# EAGLE design wiring_bord-old (EAGLE 9.5.2)
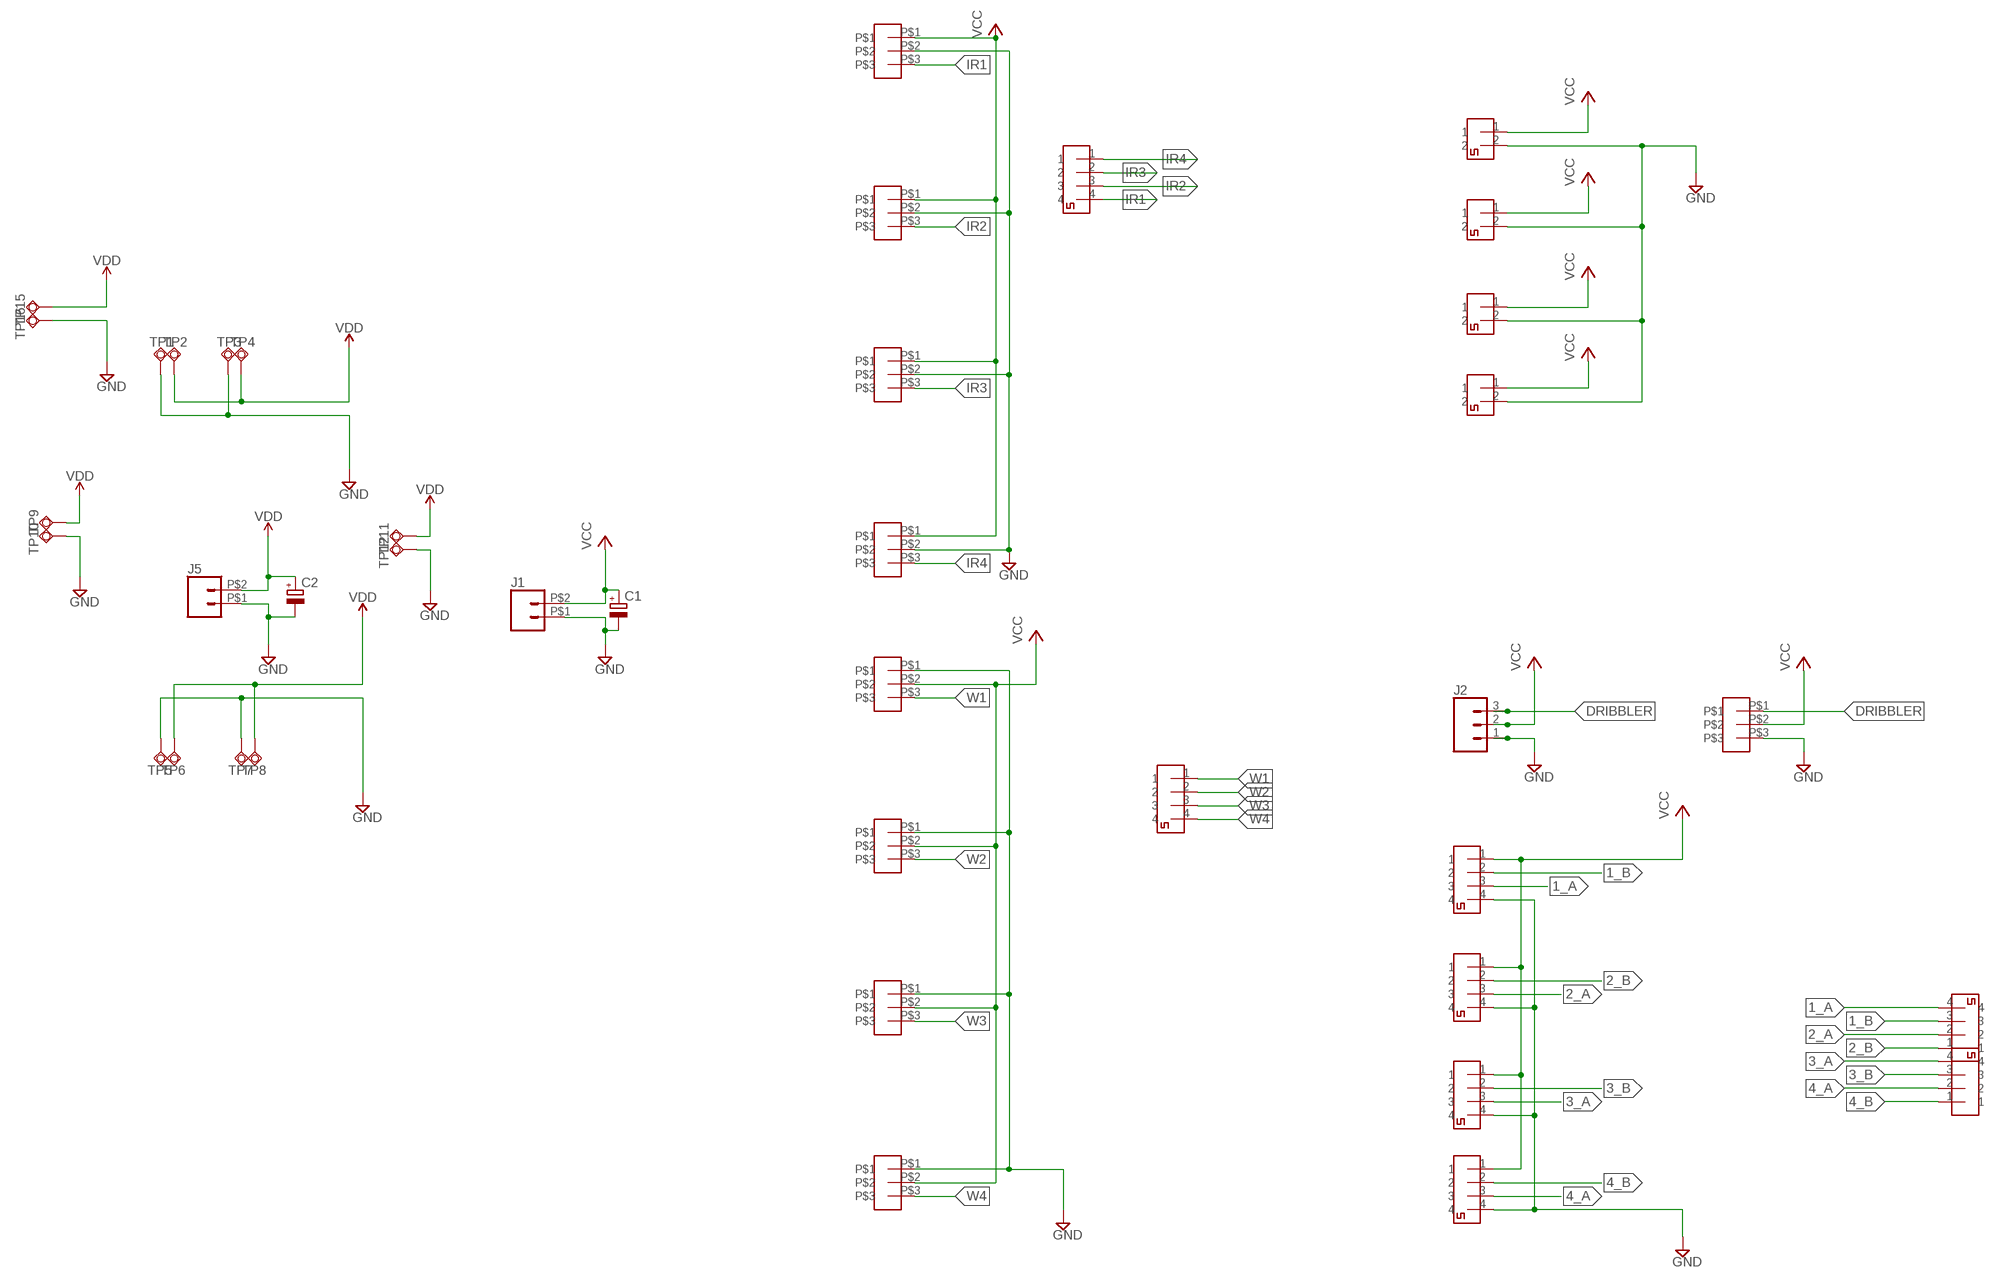
[diagram p0: schematic, sheet 1]

## Parts
C1  CPOL-EUE2-5  [E2-5]
C2  CPOL-EUE2-5  [E2-5]
CONNECTOR1  2PIN  [2PIN]
CONNECTOR2  2PIN  [2PIN]
CONNECTOR3  2PIN  [2PIN]
CONNECTOR4  2PIN  [2PIN]
CONNECTOR5  2PIN  [2PIN]
CONNECTOR6  2PIN  [2PIN]
CONNECTOR7  2PIN  [2PIN]
CONNECTOR8  2PIN  [2PIN]
ENCODER1  2PIN  [2PIN]
ENCODER2  2PIN  [2PIN]
ENCODER3  2PIN  [2PIN]
ENCODER4  2PIN  [2PIN]
IR_DISTANCE1  3PIN  [3PIN]
IR_DISTANCE2  3PIN  [3PIN]
IR_DISTANCE3  3PIN  [3PIN]
IR_DISTANCE4  3PIN  [3PIN]
J1  CONN_02PTH2  [1X02_BIG]
J2  CONN_03  [1X03]
J5  CONN_02PTH2  [1X02_BIG]
TP1  TESTPAD_TPSQPAD1-20  [TESTPAD_P1-20]
TP2  TESTPAD_TPSQPAD1-20  [TESTPAD_P1-20]
TP3  TESTPAD_TPSQPAD1-20  [TESTPAD_P1-20]
TP4  TESTPAD_TPSQPAD1-20  [TESTPAD_P1-20]
TP5  TESTPAD_TPSQPAD1-20  [TESTPAD_P1-20]
TP6  TESTPAD_TPSQPAD1-20  [TESTPAD_P1-20]
TP7  TESTPAD_TPSQPAD1-20  [TESTPAD_P1-20]
TP8  TESTPAD_TPSQPAD1-20  [TESTPAD_P1-20]
TP9  TESTPAD_TPSQPAD1-20  [TESTPAD_P1-20]
TP10  TESTPAD_TPSQPAD1-20  [TESTPAD_P1-20]
TP11  TESTPAD_TPSQPAD1-20  [TESTPAD_P1-20]
TP12  TESTPAD_TPSQPAD1-20  [TESTPAD_P1-20]
TP15  TESTPAD_TPSQPAD1-13  [TESTPAD_P1-13]
TP16  TESTPAD_TPSQPAD1-13  [TESTPAD_P1-13]
WHITE1  3PIN  [3PIN]
WHITE2  3PIN  [3PIN]
WHITE3  3PIN  [3PIN]
WHITE4  3PIN  [3PIN]
WHITE5  3PIN  [3PIN]

## Nets
1_A: CONNECTOR3.4 ENCODER1.3
1_B: CONNECTOR3.3 ENCODER1.2
2_A: CONNECTOR3.2 ENCODER2.3
2_B: CONNECTOR3.1 ENCODER2.2
3_A: CONNECTOR4.4 ENCODER3.3
3_B: CONNECTOR4.3 ENCODER3.2
4_A: CONNECTOR4.2 ENCODER4.3
4_B: CONNECTOR4.1 ENCODER4.2
DRIBBLER: J2.3 WHITE5.P$1
GND: C1.- C2.- CONNECTOR5.2 CONNECTOR6.2 CONNECTOR7.2 CONNECTOR8.2 ENCODER1.4 ENCODER2.4 ENCODER3.4 ENCODER4.4 IR_DISTANCE1.P$2 IR_DISTANCE2.P$2 IR_DISTANCE3.P$2 IR_DISTANCE4.P$2 J1.P$1 J2.1 J5.P$1 TP1.TP TP3.TP TP5.TP TP7.TP TP10.TP TP12.TP TP16.TP WHITE1.P$1 WHITE2.P$1 WHITE3.P$1 WHITE4.P$1 WHITE5.P$3
IR1: CONNECTOR1.4 IR_DISTANCE1.P$3
IR2: CONNECTOR1.3 IR_DISTANCE2.P$3
IR3: CONNECTOR1.2 IR_DISTANCE3.P$3
IR4: CONNECTOR1.1 IR_DISTANCE4.P$3
VCC: C1.+ CONNECTOR5.1 CONNECTOR6.1 CONNECTOR7.1 CONNECTOR8.1 ENCODER1.1 ENCODER2.1 ENCODER3.1 ENCODER4.1 IR_DISTANCE1.P$1 IR_DISTANCE2.P$1 IR_DISTANCE3.P$1 IR_DISTANCE4.P$1 J1.P$2 J2.2 WHITE1.P$2 WHITE2.P$2 WHITE3.P$2 WHITE4.P$2 WHITE5.P$2
VDD: C2.+ J5.P$2 TP2.TP TP4.TP TP6.TP TP8.TP TP9.TP TP11.TP TP15.TP
W1: CONNECTOR2.1 WHITE1.P$3
W2: CONNECTOR2.2 WHITE2.P$3
W3: CONNECTOR2.3 WHITE3.P$3
W4: CONNECTOR2.4 WHITE4.P$3

## Library data of the parts
C1 C2 = rcl:CPOL-EU: POLARIZED CAPACITOR, European symbol; SPICEPREFIX: C
CONNECTOR1-CONNECTOR4 ENCODER1-ENCODER4 = 4pin_small:2PIN: 2pin
CONNECTOR5-CONNECTOR8 = 2pin_small:2PIN: 2pin
IR_DISTANCE1-IR_DISTANCE4 WHITE1-WHITE5 = 3PIN_2:3PIN
J1 J5 = SparkFun-Connectors:CONN_02: Multi connection point. Often used as Generic Header-pin footprint for 0.1 inch spaced/style header connections On any of the 0.1 inch spaced packages, you can populate with these: Break Away Headers - Straight <https://www.sparkfun.com/products/116> (PRT-00116) Break Away Male Headers - Right Angle <https://www.sparkfun.com/products/553> (PRT-00553) Female Headers <https://www.sparkfun.com/products/115> (PRT-00115) Break Away Headers - Machine Pin <https://www.sparkfun.com/products/117> (PRT-00117) Break Away Female Headers - Swiss Machine Pin <https://www.sparkfun.com/products/743> (PRT-00743) For SCREWTERMINALS and SPRING TERMINALS visit here: Screw Terimnals on SparkFun.com <https://www.sparkfun.com/search/results?term=Screw+Terminals> (5mm/3.5mm/2.54mm spacing) This device is also useful as a general connection point to wire up your design to another part of your project. Our various solder wires solder well into these plated through hole pads. Hook-Up Wire - Assortment (Stranded, 22 AWG) <https://www.sparkfun.com/products/11375> (PRT-11375) Hook-Up Wire - Assortment (Solid Core, 22 AWG) <https://www.sparkfun.com/products/11367> (PRT-11367) View the entire wire category on our website here <https://www.sparkfun.com/categories/141> Special notes: Molex polarized connector foot print use with: PRT-08233 with associated crimp pins and housings. 2.54_SCREWTERM for use with PRT-10571. 3.5mm Screw Terminal footprints for PRT-08084 5mm Screw Terminal footprints for use with PRT-08432
J2 = SparkFun-Connectors:CONN_03: Multi connection point. Often used as Generic Header-pin footprint for 0.1 inch spaced/style header connections On any of the 0.1 inch spaced packages, you can populate with these: Break Away Headers - Straight <https://www.sparkfun.com/products/116> (PRT-00116) Break Away Male Headers - Right Angle <https://www.sparkfun.com/products/553> (PRT-00553) Female Headers <https://www.sparkfun.com/products/115> (PRT-00115) Break Away Headers - Machine Pin <https://www.sparkfun.com/products/117> (PRT-00117) Break Away Female Headers - Swiss Machine Pin <https://www.sparkfun.com/products/743> (PRT-00743) Stackable Header - 3 Pin (Female, 0.1") <https://www.sparkfun.com/products/13875> (PRT-13875) For SCREWTERMINALS and SPRING TERMINALS visit here: Screw Terimnals on SparkFun.com <https://www.sparkfun.com/search/results?term=Screw+Terminals> (5mm/3.5mm/2.54mm spacing) This device is also useful as a general connection point to wire up your design to another part of your project. Our various solder wires solder well into these plated through hole pads. Hook-Up Wire - Assortment (Stranded, 22 AWG) <https://www.sparkfun.com/products/11375> (PRT-11375) Hook-Up Wire - Assortment (Solid Core, 22 AWG) <https://www.sparkfun.com/products/11367> (PRT-11367) View the entire wire category on our website here <https://www.sparkfun.com/categories/141> Special notes: Molex polarized connector foot print use with SKU : PRT-08232 with associated crimp pins and housings.
TP1-TP12 TP15 TP16 = BeagleBone_Blue_R3:TESTPAD_TPSQ: Test pad

## Board
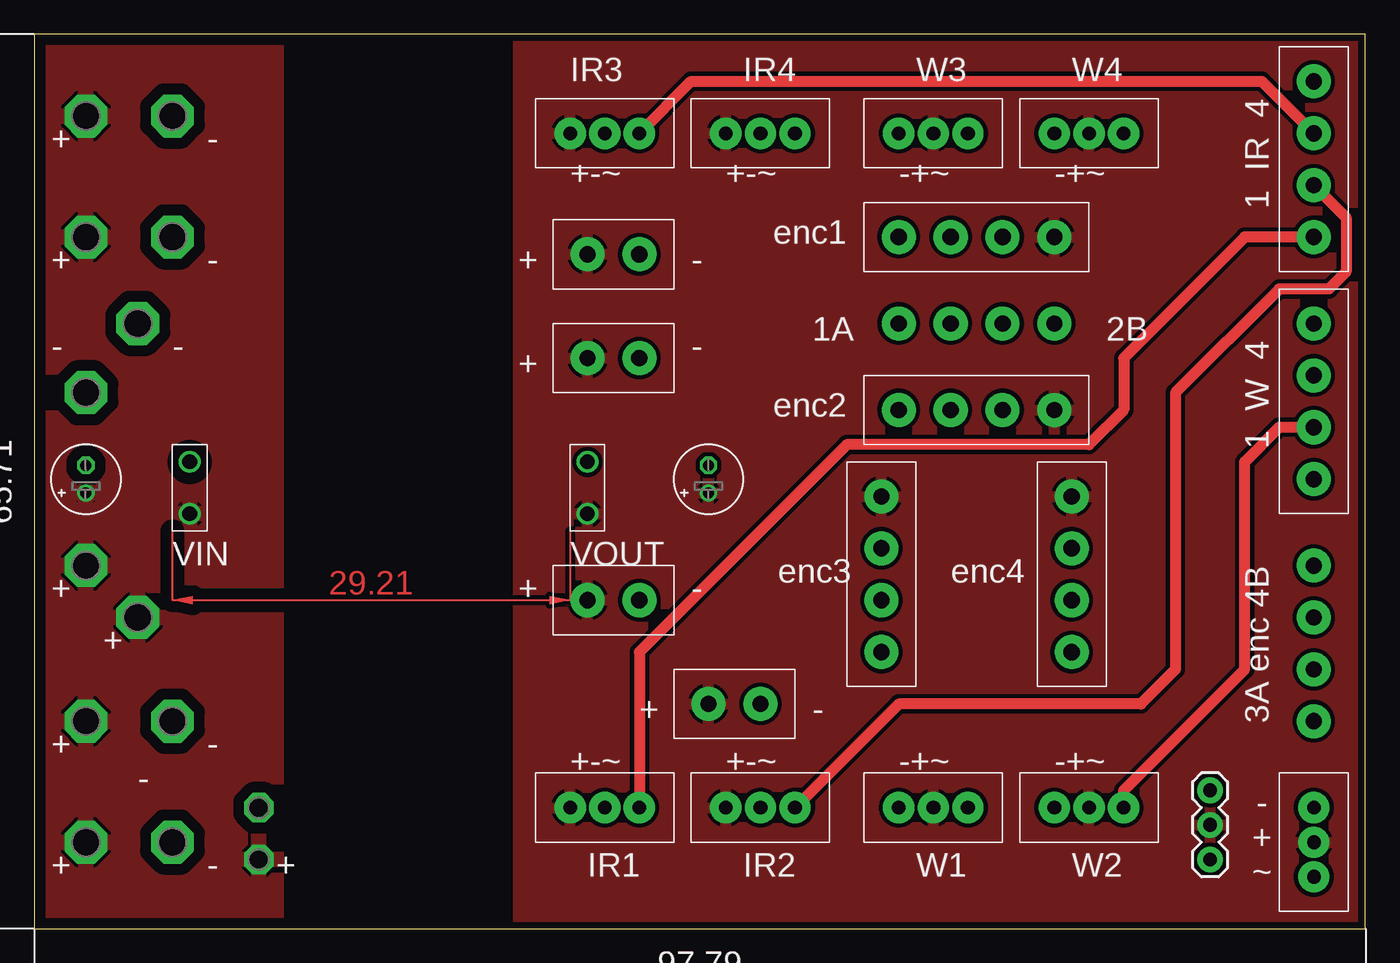
[diagram p1: board, top side]
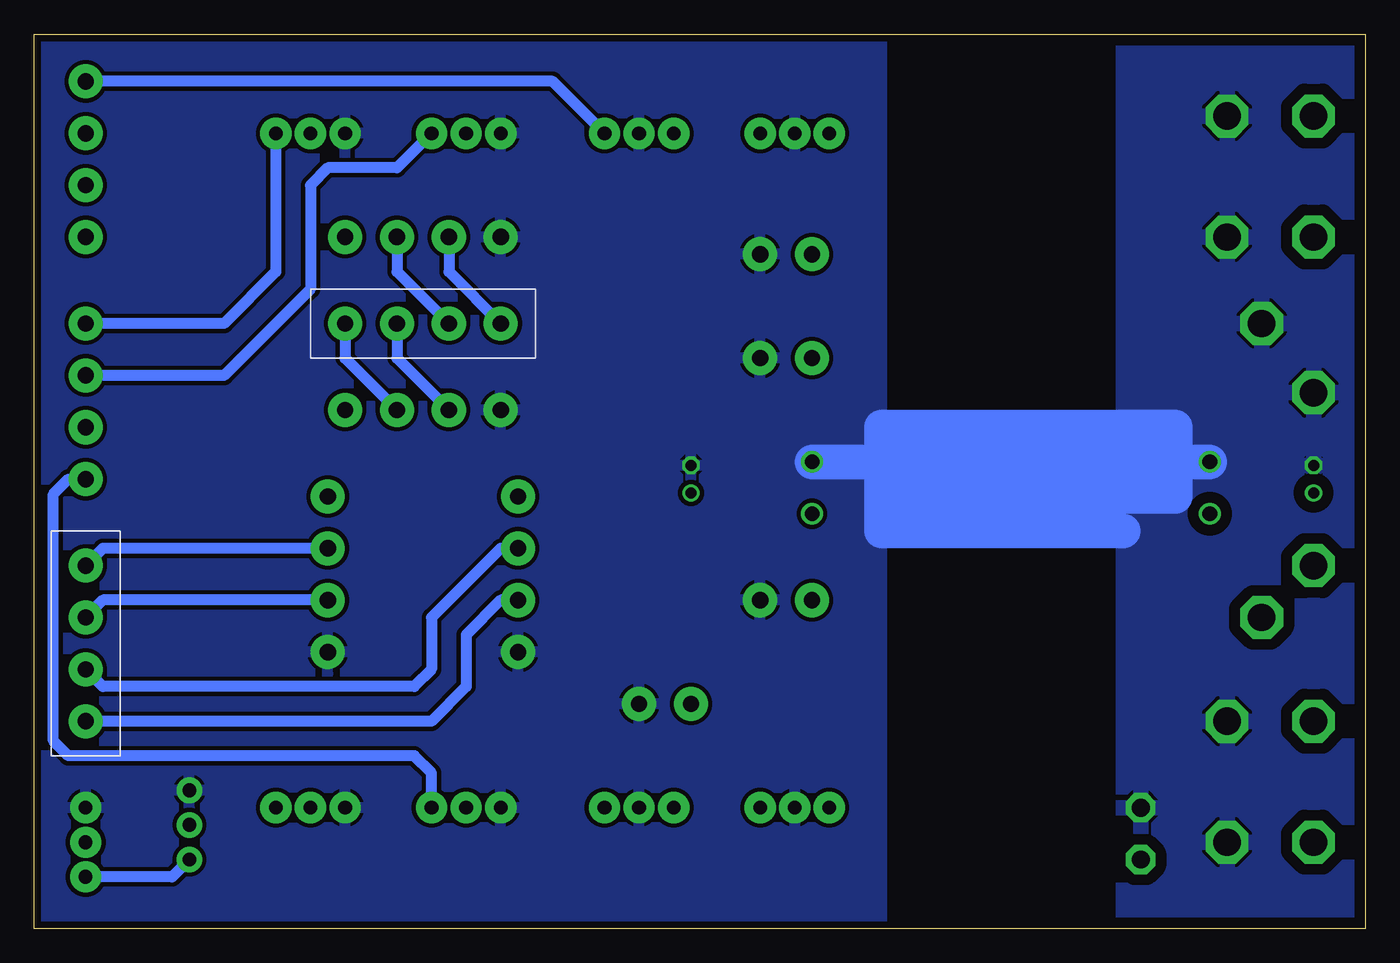
[diagram p2: board, bottom side, seen from below]

Size 97.77 x 65.71 mm. Coordinates in mm from the lower left corner, seen from the top.
Outline: 0,0 97.77,0 97.77,65.71 0,65.71 0,0
Copper layers (1*16): Top 0.035mm / dielectric 1.6mm / Bottom 0.035mm
Design rules "Elecrow_2-layer_PCB_eagle_rule": minimum track width 6mil, minimum drill 12mil, track to track 6mil, track to pad 6mil, pad to pad 6mil, via to via 8mil, smd to smd 0mil, copper to edge 20mil, drill to drill 10mil, minimum pad ring 6mil, minimum via ring 6mil, stop-mask expansion 0mil, vias tented up to drill 100mil, thermal gap 10mil

### Footprints (pad centres in the part's own frame; a part is rotated, then mirrored left to right if it is on the bottom)
E2-5 = drill 0.813 pad 1.27: + -1.016,0 | drill 0.813 pad 1.27 octagon: - 1.016,0
2PIN = drill 1.2 pad 2.5: 1 0,0; 2 3.81,0; 3 7.62,0; 4 11.43,0
2PIN' = drill 1.2 pad 2.5: 1 0,0; 2 3.81,0
3PIN = drill 1 pad 2.3: P$1 0,0; P$2 2.54,0; P$3 5.08,0
1X02_BIG = drill 1.067: P$1 0,0; P$2 3.81,0
1X03 = drill 1.016 pad 1.88: 1 0,0; 2 2.54,0; 3 5.08,0
TESTPAD_P1-20 = drill 2.007 pad 3.15 octagon: TP 0,0
TESTPAD_P1-13 = drill 1.321 pad 2.159 octagon: TP 0,0

### Placement (x,y rotation side)
C1  49.53,33.02 90 top
C2  3.81,33.02 90 top
CONNECTOR1  93.98,62.23 270 top
CONNECTOR2  93.98,33.02 90 top
CONNECTOR3  74.93,44.45 0 bottom
CONNECTOR4  93.98,26.67 270 bottom
CONNECTOR5  2PIN  [2PIN']  40.64,49.53 0 top
CONNECTOR6  2PIN  [2PIN']  40.64,41.91 0 top
CONNECTOR7  2PIN  [2PIN']  49.53,16.51 0 top
CONNECTOR8  2PIN  [2PIN']  40.64,24.13 0 top
ENCODER1  74.93,50.8 180 top
ENCODER2  74.93,38.1 180 top
ENCODER3  62.23,31.75 270 top
ENCODER4  76.2,31.75 270 top
IR_DISTANCE1  39.37,8.89 0 top
IR_DISTANCE2  50.8,8.89 0 top
IR_DISTANCE3  39.37,58.42 0 top
IR_DISTANCE4  50.8,58.42 0 top
J1  40.64,34.29 270 top
J2  86.36,10.16 270 top
J5  11.43,34.29 270 top
TP1  10.16,59.69 0 top
TP2  3.81,59.69 0 top
TP3  10.16,50.8 0 top
TP4  3.81,50.8 0 top
TP5  10.16,6.35 0 top
TP6  3.81,6.35 0 top
TP7  10.16,15.24 0 top
TP8  3.81,15.24 0 top
TP9  3.81,26.67 0 top
TP10  3.81,39.37 0 top
TP11  7.62,22.86 0 top
TP12  7.62,44.45 0 top
TP15  16.51,5.08 0 top
TP16  16.51,8.89 0 top
WHITE1  63.5,8.89 0 top
WHITE2  74.93,8.89 0 top
WHITE3  63.5,58.42 0 top
WHITE4  74.93,58.42 0 top
WHITE5  93.98,3.81 90 top

### Tracks (layer width: path | path; a pad name or v marks a point on that pad's centre or on a via)
1_A
  Bottom 0.813: CONNECTOR3.4 67.31,48.26 ENCODER1.3
1_B
  Bottom 0.813: CONNECTOR3.3 71.12,48.26 ENCODER1.2
2_A
  Bottom 0.813: CONNECTOR3.2 71.12,41.91 ENCODER2.3
2_B
  Bottom 0.813: CONNECTOR3.1 74.93,41.91 ENCODER2.2
3_A
  Bottom 0.813: CONNECTOR4.4 68.58,15.24 66.04,17.78 66.04,21.59 63.5,24.13 ENCODER3.3
3_B
  Bottom 0.813: CONNECTOR4.3 92.71,17.78 69.85,17.78 68.58,19.05 68.58,22.86 63.5,27.94 ENCODER3.2
4_A
  Bottom 0.813: CONNECTOR4.2 92.71,24.13 ENCODER4.3
4_B
  Bottom 0.813: CONNECTOR4.1 92.71,27.94 ENCODER4.2
DRIBBLER
  Bottom 0.813: J2.3 87.63,3.81 WHITE5.P$1
GND
  Bottom 2.54: J5.P$1 15.24,34.29 | 15.24,34.29 J1.P$1 | 15.24,34.29 15.24,35.56 35.56,35.56 35.56,36.83 13.97,36.83 13.97,31.75 35.56,31.75 | 35.56,31.75 35.56,33.02 | 35.56,31.75 35.56,29.21 17.78,29.21
  pour Bottom (isolate 0.813): 0,64.77 17.78,64.77 17.78,0 0,0
  pour Bottom (isolate 0.305): 35.56,66.04 35.56,0 97.79,0 97.79,66.04
IR1
  Top 0.813: CONNECTOR1.4 88.9,50.8 80.01,41.91 80.01,38.1 77.47,35.56 59.69,35.56 44.45,20.32 IR_DISTANCE1.P$3
IR2
  Top 0.813: IR_DISTANCE2.P$3 63.5,16.51 81.28,16.51 83.82,19.05 83.82,39.37 91.44,46.99 95.08,46.99 96.35,48.26 96.35,52.24 CONNECTOR1.3
IR3
  Top 0.813: IR_DISTANCE3.P$3 48.26,62.23 90.17,62.23 CONNECTOR1.2
IR4
  Bottom 0.813: IR_DISTANCE4.P$3 59.69,62.23 CONNECTOR1.1
VCC
  pour Top (isolate 0.305): 35.56,66.04 35.56,0 97.79,0 97.79,66.04
VDD
  pour Top (isolate 0.813): 0,64.77 17.78,64.77 17.78,0 0,0
W1
  Bottom 0.813: WHITE1.P$3 68.58,11.43 69.85,12.7 95.25,12.7 96.35,13.8 96.35,31.92 95.25,33.02 CONNECTOR2.1
W2
  Top 0.813: CONNECTOR2.2 91.44,36.83 88.9,34.29 88.9,19.05 80.01,10.16 WHITE2.P$3
W3
  Bottom 0.813: WHITE3.P$3 71.12,55.88 76.2,55.88 77.47,54.61 77.47,46.99 83.82,40.64 CONNECTOR2.3
W4
  Bottom 0.813: WHITE4.P$3 80.01,48.26 83.82,44.45 CONNECTOR2.4
(copper drawn outside any net)
  shapes: Top area x1

### Text on the board
tPlace: 1 IR 4 | enc1 | 1A | 2B | 1 W 4 | enc2 | VIN | VOUT | 3A enc 4B | enc3 | enc4
tNames: IR3 | IR4 | W3 | W4 | + | - | +-~ | +-~ | -+~ | -+~ | + | - | + | - | - | - | - | + | + | + | - | + | + | - | + | - | +-~ | +-~ | -+~ | -+~ | - | - | + | ~ | + | - | + | IR1 | IR2 | W1 | W2